# Altium schematic sheet 04-VIDEO_OUT.SchDoc
size A4
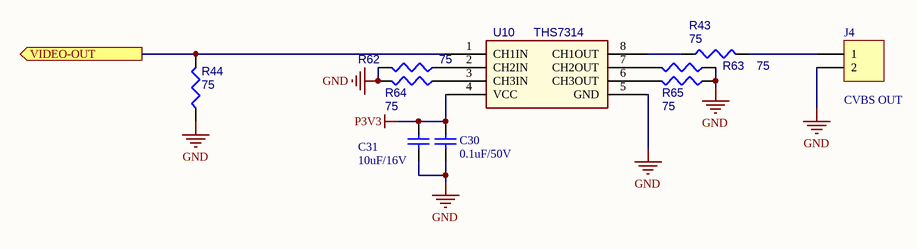
[diagram p0: 04-VIDEO_OUT.SchDoc]

## Parts
C30  0.1uF/50V  [0402]
C31  10uF/16V  [0805]
J4  CVBS OUT  [CONN-2.0-SMD-2P-V]
R43  75  [0402]
R44  75  [0402]
R62  75  [0402]
R63  75  [0402]
R64  75  [0402]
R65  75  [0402]
U10  THS7314  [so8]

## Ports
VIDEO-OUT (out)

## Nets
GND: C30.2 C31.2 J4.2 R44.1 R62.2 R63.1 R64.2 R65.1 U10.5(GND)
P3V3: C30.1 C31.1 U10.4(VCC)
VIDEO-OUT: R44.2 U10.1(CH1IN) ; port VIDEO-OUT
NetJ4_1: J4.1 R43.2
NetR43_1: R43.1 U10.8(CH1OUT)
NetR62_1: R62.1 U10.2(CH2IN)
NetR63_2: R63.2 U10.7(CH2OUT)
NetR64_1: R64.1 U10.3(CH3IN)
NetR65_2: R65.2 U10.6(CH3OUT)

## Library data of the parts
C30 C31 = Cap: Capacitor; Published: 8-Jun-2000; LatestRevisionDate: 17-Jul-2002; LatestRevisionNote: Re-released for DXP Platform.; PackageReference: RAD-0.3; Publisher: Altium Limited; PackageDescription: Radial Cap, Thru-Hole; 2 Leads; 0.3 in Pin Spacing
J4 = Header 2: Header, 2-Pin; LatestRevisionDate: 17-Jul-2002; LatestRevisionNote: Re-released for DXP Platform.; Publisher: Altium Limited
R43 R44 R62-R65 = R: Manufacturer Part number: null; Part Description: S RES 1/16W 10K +-5% 0402; Part Number: SD02810028L; ROOM: SD; Deletion Flag: 0; Function Field: 32.3; Ecology: YES; Part Type: RESISTOR; AP Sheet: http://ISPDPRD/Windchill/servlet/WindchillAuthGW/wt.enterprise.URLProcessor/URLTemplateAction?u8&oid=VR%3Aext.compal.part.Comp; AP: AP; Lead Free: Y1